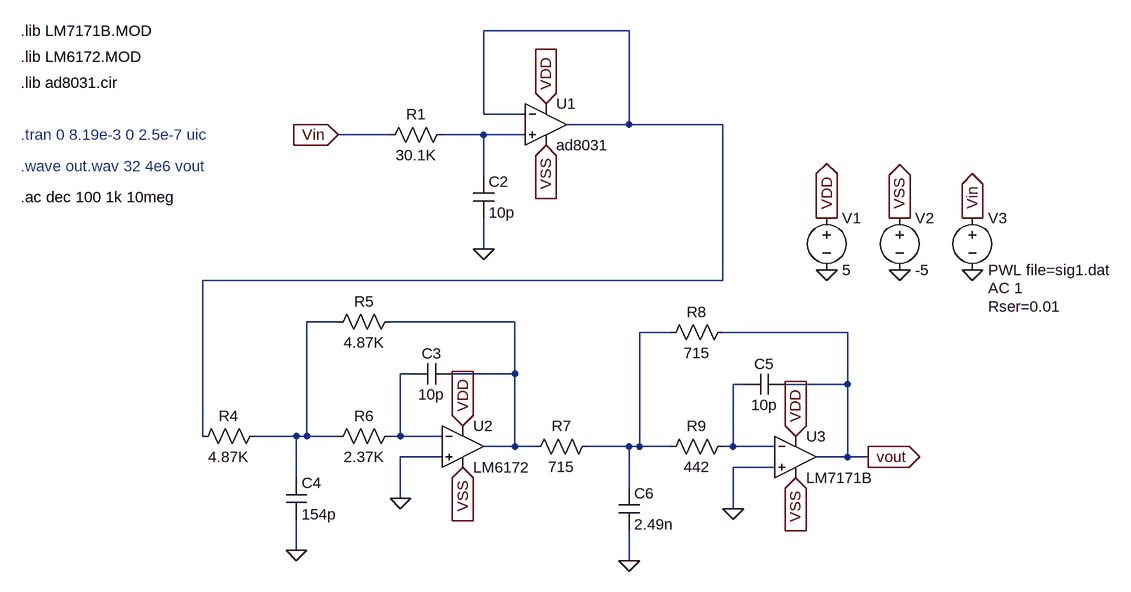
[diagram p0: schematic 7db-181-198-3stage-5order.asc]
7db-181-198-3stage-5order.asc, the LTspice schematic file:
Version 4
SHEET 1 1712 680
WIRE 448 -304 224 -304
WIRE 224 -176 224 -304
WIRE 288 -176 224 -176
WIRE 448 -160 448 -304
WIRE 448 -160 352 -160
WIRE 592 -160 448 -160
WIRE 80 -144 0 -144
WIRE 224 -144 160 -144
WIRE 288 -144 224 -144
WIRE 224 -80 224 -144
WIRE 224 32 224 -16
WIRE 592 80 592 -160
WIRE 592 80 -208 80
WIRE 0 144 -48 144
WIRE 272 144 80 144
WIRE 512 160 464 160
WIRE 784 160 592 160
WIRE 112 224 96 224
WIRE 272 224 272 144
WIRE 272 224 176 224
WIRE 624 240 608 240
WIRE 784 240 784 160
WIRE 784 240 688 240
WIRE -208 320 -208 80
WIRE -64 320 -128 320
WIRE -48 320 -48 144
WIRE -48 320 -64 320
WIRE 0 320 -48 320
WIRE 96 320 96 224
WIRE 96 320 80 320
WIRE 160 320 96 320
WIRE 272 336 272 224
WIRE 272 336 224 336
WIRE 304 336 272 336
WIRE 448 336 384 336
WIRE 464 336 464 160
WIRE 464 336 448 336
WIRE 512 336 464 336
WIRE 608 336 608 240
WIRE 608 336 592 336
WIRE 672 336 608 336
WIRE 160 352 96 352
WIRE 784 352 784 240
WIRE 784 352 736 352
WIRE 816 352 784 352
WIRE 672 368 608 368
WIRE -64 384 -64 320
WIRE 448 400 448 336
WIRE 96 416 96 352
WIRE 608 432 608 368
WIRE -64 496 -64 448
WIRE 448 512 448 464
FLAG 224 32 0
FLAG -64 496 0
FLAG 96 416 0
FLAG 448 512 0
FLAG 608 432 0
FLAG 816 352 vout
IOPIN 816 352 Out
FLAG 320 -128 VSS
IOPIN 320 -128 In
FLAG 192 368 VSS
IOPIN 192 368 In
FLAG 704 384 VSS
IOPIN 704 384 In
FLAG 192 304 VDD
IOPIN 192 304 In
FLAG 704 320 VDD
IOPIN 704 320 In
FLAG 320 -192 VDD
IOPIN 320 -192 In
FLAG 752 64 0
FLAG 864 64 0
FLAG 752 -16 VDD
IOPIN 752 -16 Out
FLAG 864 -16 VSS
IOPIN 864 -16 Out
FLAG 0 -144 Vin
IOPIN 0 -144 In
FLAG 976 64 0
FLAG 976 -16 Vin
IOPIN 976 -16 Out
SYMBOL res 176 -160 R90
WINDOW 0 0 56 VBottom 2
WINDOW 3 32 56 VTop 2
SYMATTR InstName R1
SYMATTR Value 30.1K
SYMBOL cap 208 -80 R0
SYMATTR InstName C2
SYMATTR Value 10p
SYMBOL Opamps\\opamp2 320 -224 R0
SYMATTR InstName U1
SYMATTR Value ad8031
SYMBOL res -112 304 R90
WINDOW 0 0 56 VBottom 2
WINDOW 3 32 56 VTop 2
SYMATTR InstName R4
SYMATTR Value 4.87K
SYMBOL res 96 128 R90
WINDOW 0 0 56 VBottom 2
WINDOW 3 32 56 VTop 2
SYMATTR InstName R5
SYMATTR Value 4.87K
SYMBOL res 96 304 R90
WINDOW 0 0 56 VBottom 2
WINDOW 3 32 56 VTop 2
SYMATTR InstName R6
SYMATTR Value 2.37K
SYMBOL cap 176 208 R90
WINDOW 0 0 32 VBottom 2
WINDOW 3 32 32 VTop 2
SYMATTR InstName C3
SYMATTR Value 10p
SYMBOL cap -80 384 R0
SYMATTR InstName C4
SYMATTR Value 154p
SYMBOL Opamps\\opamp2 192 272 R0
SYMATTR InstName U2
SYMATTR Value LM6172
SYMBOL res 400 320 R90
WINDOW 0 0 56 VBottom 2
WINDOW 3 32 56 VTop 2
SYMATTR InstName R7
SYMATTR Value 715
SYMBOL res 608 144 R90
WINDOW 0 0 56 VBottom 2
WINDOW 3 32 56 VTop 2
SYMATTR InstName R8
SYMATTR Value 715
SYMBOL res 608 320 R90
WINDOW 0 0 56 VBottom 2
WINDOW 3 32 56 VTop 2
SYMATTR InstName R9
SYMATTR Value 442
SYMBOL cap 688 224 R90
WINDOW 0 0 32 VBottom 2
WINDOW 3 32 32 VTop 2
SYMATTR InstName C5
SYMATTR Value 10p
SYMBOL cap 432 400 R0
SYMATTR InstName C6
SYMATTR Value 2.49n
SYMBOL Opamps\\opamp2 704 288 R0
SYMATTR InstName U3
SYMATTR Value LM7171B
SYMBOL voltage 752 -32 R0
WINDOW 123 0 0 Left 0
WINDOW 39 0 0 Left 0
SYMATTR InstName V1
SYMATTR Value 5
SYMBOL voltage 864 -32 R0
WINDOW 123 0 0 Left 0
WINDOW 39 0 0 Left 0
SYMATTR InstName V2
SYMATTR Value -5
SYMBOL voltage 976 -32 R0
WINDOW 123 24 124 Left 2
WINDOW 39 24 152 Left 2
SYMATTR Value2 AC 1
SYMATTR SpiceLine Rser=0.01
SYMATTR InstName V3
SYMATTR Value PWL file=sig1.dat
TEXT -488 -144 Left 2 ;.tran 0 8.19e-3 0 2.5e-7 uic
TEXT -488 -96 Left 2 ;.wave out.wav 32 4e6 vout
TEXT -488 -304 Left 2 !.lib LM7171B.MOD
TEXT -488 -264 Left 2 !.lib LM6172.MOD
TEXT -488 -224 Left 2 !.lib ad8031.cir
TEXT -488 -48 Left 2 !.ac dec 100 1k 10meg

The netlist it stands for:
* 7db-181-198-3stage-5order.asc
R1 N002 Vin 30.1K
C2 N002 0 10p
XU1 N002 N001 VDD VSS N001 ad8031  ; pins In+ In- V+ V- OUT
R4 N003 N001 4.87K
R5 N004 N003 4.87K
R6 N006 N003 2.37K
C3 N004 N006 10p
C4 N003 0 154p
XU2 0 N006 VDD VSS N004 LM6172  ; pins In+ In- V+ V- OUT
R7 N005 N004 715
R8 vout N005 715
R9 N007 N005 442
C5 vout N007 10p
C6 N005 0 2.49n
XU3 0 N007 VDD VSS vout LM7171B  ; pins In+ In- V+ V- OUT
V1 VDD 0 5
V2 VSS 0 -5
V3 Vin 0 PWL file=sig1.dat AC 1 Rser=0.01
* .tran 0 8.19e-3 0 2.5e-7 uic
* .wave out.wav 32 4e6 vout
.lib LM7171B.MOD
.lib LM6172.MOD
.lib ad8031.cir
.ac dec 100 1k 10meg
.backanno
.end